# EAGLE design MODULO1 (EAGLE 7.1.0)
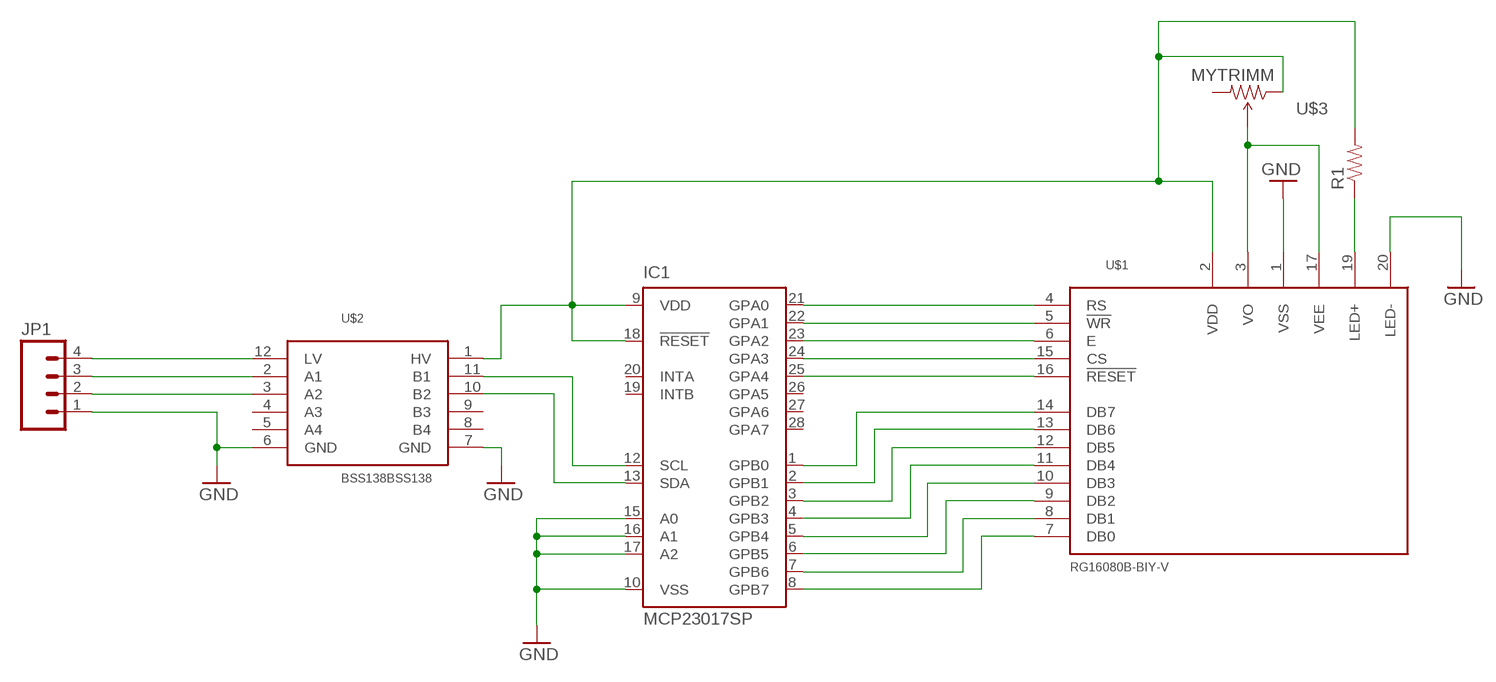
[diagram p0: schematic, sheet 1]

## Parts
IC1  MCP23017SP  [DIL28-3]
JP1  M04PTH  [1X04]
R1  RESISTOR0805-RES  [0805]
U$1  RG16080B-BIY-V  [1X20]
U$2  BSS138BSS138  [BSS138]
U$3  MYTRIMM  [MYTRIMM]

## Nets
GND: IC1.10(VSS) IC1.15(A0) IC1.16(A1) IC1.17(A2) JP1.1 U$1.1(VSS) U$1.20(LED-) U$2.6(GND) U$2.7(GND)
N$1: IC1.21(GPA0) U$1.4(RS)
N$2: IC1.22(GPA1) U$1.5(!WR)
N$3: IC1.23(GPA2) U$1.6(E)
N$4: IC1.24(GPA3) U$1.15(CS)
N$5: IC1.25(GPA4) U$1.16(!RESET)
N$6: IC1.1(GPB0) U$1.14(DB7)
N$7: IC1.2(GPB1) U$1.13(DB6)
N$8: IC1.3(GPB2) U$1.12(DB5)
N$9: IC1.4(GPB3) U$1.11(DB4)
N$10: IC1.5(GPB4) U$1.10(DB3)
N$11: IC1.6(GPB5) U$1.9(DB2)
N$12: IC1.7(GPB6) U$1.8(DB1)
N$13: IC1.8(GPB7) U$1.7(DB0)
N$14: IC1.9(VDD) IC1.18(!RESET) R1.2 U$1.2(VDD) U$2.1(HV) U$3.1(CCW)
N$15: IC1.12(SCL) U$2.11(B1)
N$16: IC1.13(SDA) U$2.10(B2)
N$17: JP1.4 U$2.12(LV)
N$18: JP1.3 U$2.2(A1)
N$19: JP1.2 U$2.3(A2)
N$21: U$1.3(VO) U$1.17(VEE) U$3.2(WIPER)
N$22: R1.1 U$1.19(LED+)
Unconnected: IC1.19(INTB) IC1.20(INTA) IC1.26(GPA5) IC1.27(GPA6) IC1.28(GPA7) U$2.4(A3) U$2.5(A4) U$2.8(B4) U$2.9(B3) U$3.3(CW)

## Library data of the parts
IC1 = microchip:MCP23017: http://ww1.microchip.com/downloads/en/DeviceDoc/21952a.pdf Source: http://ww1.microchip.com/downloads/en/DeviceDoc/21952a.pdf; MF: MICROCHIP; MPN: MCP23017-E/SP; OC_FARNELL: 1332088; OC_NEWARK: 31K2959
JP1 = SparkFun-Connectors:M04: Header 4 Standard 4-pin 0.1" header. Use with straight break away headers (SKU : PRT-00116), right angle break away headers (PRT-00553), swiss pins (PRT-00743), machine pins (PRT-00117), and female headers (PRT-00115). Molex polarized connector foot print use with SKU : PRT-08231 with associated crimp pins and housings. 1MM SMD Version SKU: PRT-10208
R1 = SparkFun-Resistors:RESISTOR: Resistor Basic schematic elements and footprints for 0603, 1206, and PTH resistors.
U$1 = SparkFun-Displays:RG16080B-BIY-V
U$2 = SparkFun-DigitalIC:BSS138: Description: Logic Coverter
U$3 = SparkFun-Electromechanical:MYTRIMM

## Board
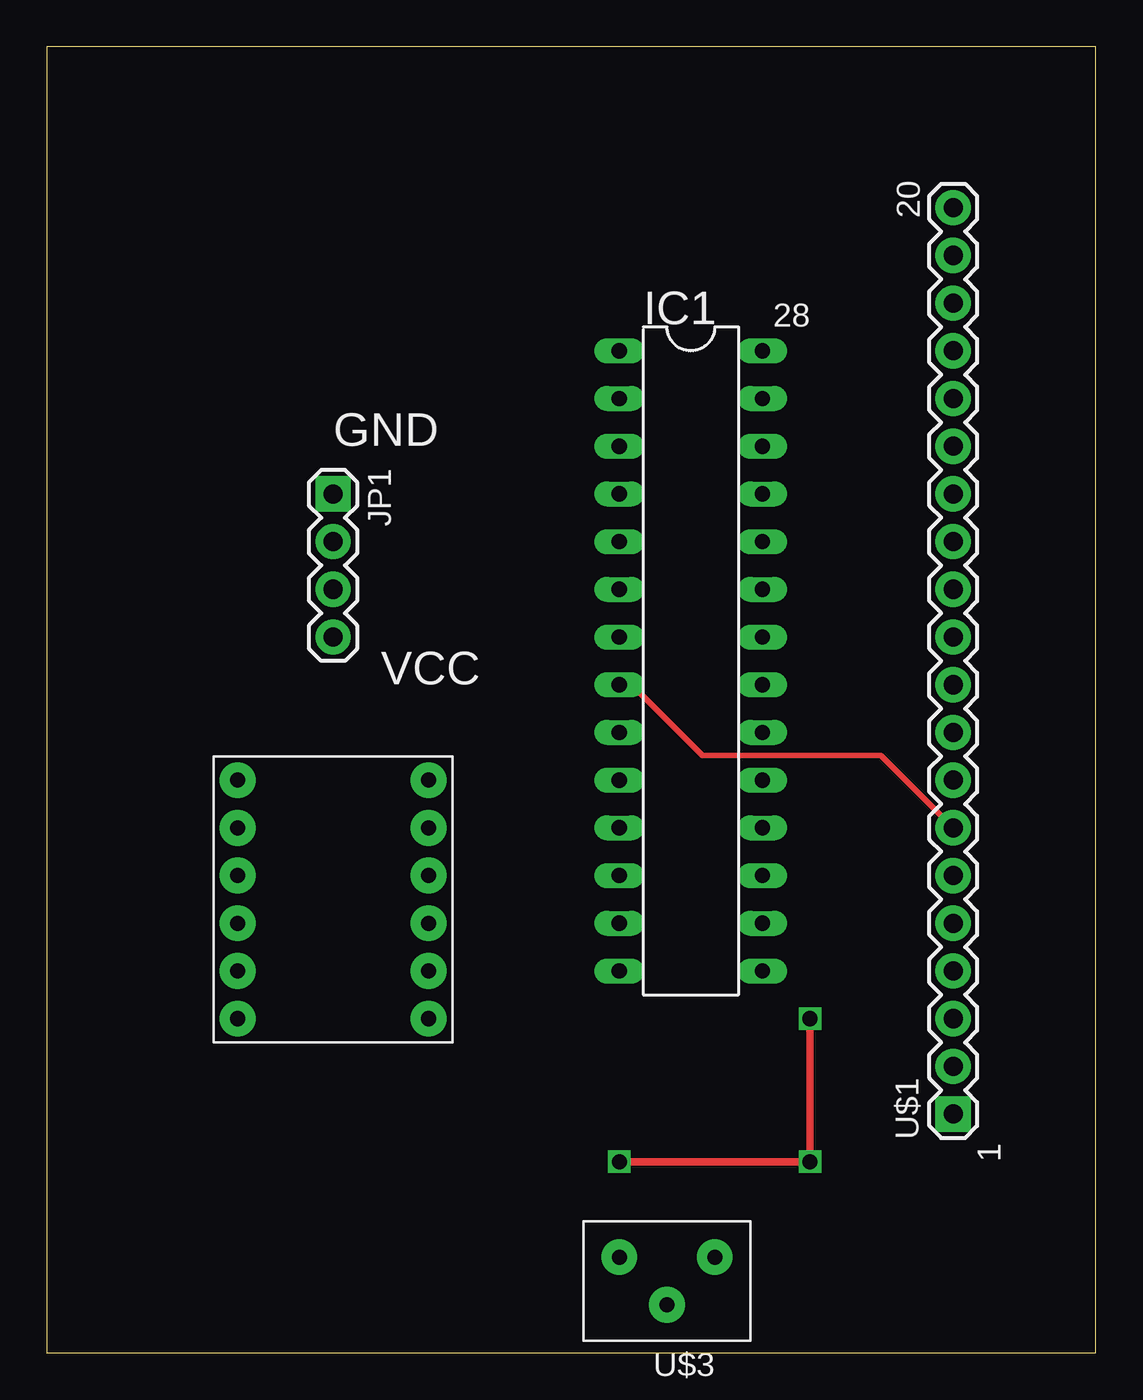
[diagram p1: board, top side]
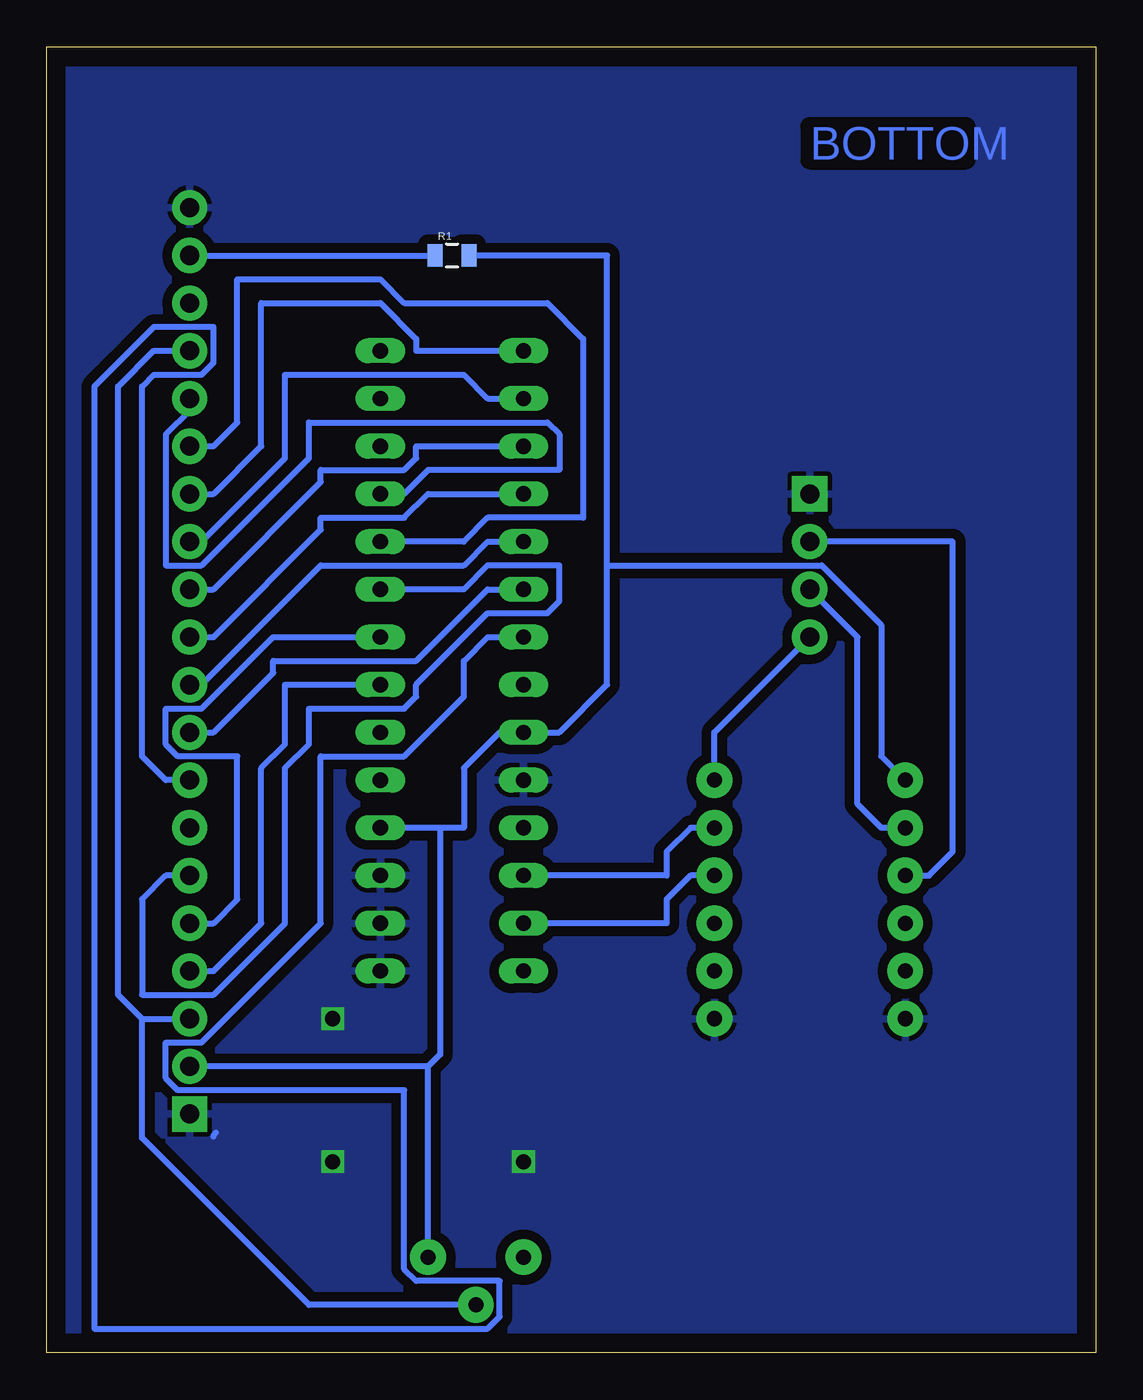
[diagram p2: board, bottom side, seen from below]

Size 55.86 x 69.52 mm. Coordinates in mm from the lower left corner, seen from the top.
Outline: 0,0 55.86,0 55.86,69.52 0,69.52 0,0
Copper layers (1*16): Top 0.035mm / dielectric 1.5mm / Bottom 0.035mm
Design rules "default *": minimum track width 13mil, minimum drill 24mil, track to track 20mil, track to pad 6mil, pad to pad 8mil, via to via 8mil, smd to smd 8mil, copper to edge 40mil, drill to drill 8mil, minimum pad ring 10mil, minimum via ring 8mil, stop-mask expansion 4mil, vias tented up to drill 0mil, thermal gap 10mil

### Footprints (pad centres in the part's own frame; a part is rotated, then mirrored left to right if it is on the bottom)
DIL28-3 = drill 0.813 long: 1 -16.51,-3.81; 2 -13.97,-3.81; 3 -11.43,-3.81; 4 -8.89,-3.81; 5 -6.35,-3.81; 6 -3.81,-3.81; 7 -1.27,-3.81; 8 1.27,-3.81; 9 3.81,-3.81; 10 6.35,-3.81; 11 8.89,-3.81; 12 11.43,-3.81; 13 13.97,-3.81; 14 16.51,-3.81; 15 16.51,3.81; 16 13.97,3.81; 17 11.43,3.81; 18 8.89,3.81; 19 6.35,3.81; 20 3.81,3.81; 21 1.27,3.81; 22 -1.27,3.81; 23 -3.81,3.81; 24 -6.35,3.81; 25 -8.89,3.81; 26 -11.43,3.81; 27 -13.97,3.81; 28 -16.51,3.81
1X04 = drill 1.016 pad 1.88 square: 1 0,0 | drill 1.016 pad 1.88: 2 2.54,0; 3 5.08,0; 4 7.62,0
0805 = smd 0.8 x 1.2: 1 -0.9,0; 2 0.9,0
1X20 = drill 1.016 pad 1.88 square: 1 0,0 | drill 1.016 pad 1.88: 2 2.54,0; 3 5.08,0; 4 7.62,0; 5 10.16,0; 6 12.7,0; 7 15.24,0; 8 17.78,0; 9 20.32,0; 10 22.86,0; 11 25.4,0; 12 27.94,0; 13 30.48,0; 14 33.02,0; 15 35.56,0; 16 38.1,0; 17 40.64,0; 18 43.18,0; 19 45.72,0; 20 48.26,0
BSS138 = drill 0.8 pad 1.905: 1 -5.08,6.35; 2 -5.08,3.81; 3 -5.08,1.27; 4 -5.08,-1.27; 5 -5.08,-3.81; 6 -5.08,-6.35; 7 5.08,-6.35; 8 5.08,-3.81; 9 5.08,-1.27; 10 5.08,1.27; 11 5.08,3.81; 12 5.08,6.35
MYTRIMM = drill 0.8 pad 1.905: 1 -2.54,0; 2 0,2.54; 3 2.54,0

### Placement (x,y rotation side)
IC1  34.29,36.83 270 top
JP1  15.24,45.72 270 top
R1  34.29,58.42 0 bottom
U$1  48.26,12.7 90 top
U$2  15.24,24.13 0 top
U$3  33.02,5.08 180 top

### Tracks (layer width: path | path; a pad name or v marks a point on that pad's centre or on a via)
GND  (via drill 0.8)
  Top 0.406: v30.48,10.16 v40.64,10.16 v40.64,17.78
  Bottom 0.33: 47,11.5 46.86,11.7
  pour Bottom (isolate 0.508): 0,0 0,68.58 55.88,68.58 55.88,0
N$1
  Bottom 0.33: IC1.21 43.18,35.56 43.18,32.38 44.45,31.11 44.45,22.86 46.99,20.32 U$1.4
N$2
  Bottom 0.33: IC1.22 43.81,38.1 47.62,34.29 49.53,34.29 49.53,32.38 48.9,31.75 45.72,31.75 45.72,24.13 46.99,22.86 U$1.5
N$3
  Bottom 0.33: IC1.23 33.66,40.64 32.38,41.91 28.57,41.91 28.57,40.01 29.21,39.37 32.38,39.37 36.2,35.56 36.2,34.92 36.83,34.29 41.91,34.29 41.91,32.38 43.18,31.11 43.18,22.86 46.99,19.05 50.8,19.05 50.8,24.13 49.53,25.4 U$1.6
N$4
  Bottom 0.33: IC1.24 33.66,43.18 32.38,44.45 27.3,44.45 27.3,53.98 29.21,55.88 36.83,55.88 38.1,57.15 45.72,57.15 45.72,49.53 46.99,48.26 U$1.15
N$5
  Bottom 0.33: IC1.25 36.83,45.72 35.56,46.99 28.57,46.99 28.57,48.9 29.21,49.53 41.91,49.53 41.91,47.62 47.62,41.91 49.53,41.91 49.53,48.9 48.26,50.16 U$1.16
N$6
  Bottom 0.33: IC1.1 36.2,53.34 36.2,53.98 38.1,55.88 44.45,55.88 44.45,48.26 46.99,45.72 U$1.14
N$7
  Bottom 0.33: IC1.2 32.38,50.8 33.66,52.07 43.18,52.07 43.18,47.62 47.62,43.18 U$1.13
N$8
  Bottom 0.33: IC1.3 36.2,48.26 36.2,47.62 36.83,46.99 41.27,46.99 41.27,46.35 46.99,40.64 U$1.12
N$9
  Bottom 0.33: IC1.4 35.56,45.72 36.83,44.45 41.27,44.45 41.27,43.81 46.99,38.1 U$1.11
N$10
  Bottom 0.33: IC1.5 32.38,43.18 33.66,41.91 41.27,41.91 47.62,35.56 U$1.10
N$11
  Bottom 0.33: IC1.6 32.38,40.64 36.2,36.83 43.81,36.83 43.81,36.2 46.99,33.02 U$1.9
N$12
  Bottom 0.33: IC1.7 32.38,38.1 33.66,36.83 33.66,34.92 36.83,31.75 41.27,31.75 41.27,22.86 47.62,16.51 49.53,16.51 49.53,14.61 48.9,13.97 36.83,13.97 36.83,4.45 36.2,3.81 31.75,3.81 31.75,1.91 32.38,1.27 53.34,1.27 53.34,51.44 50.16,54.61 46.99,54.61 46.99,52.7 47.62,52.07 50.16,52.07 50.8,51.44 50.8,31.75 49.53,30.48 U$1.8
N$13
  Top 0.305: IC1.8 31.14,35.56 34.9,31.8 44.4,31.8 U$1.7
N$14
  Bottom 0.33: 35.56,15.24 U$1.2 | U$3.1 35.56,15.24 | R1.2 26.04,58.42 26.04,41.91 | 26.04,41.91 26.04,35.56 28.57,33.02 IC1.9 31.75,33.02 33.66,31.11 33.66,27.94 34.92,27.94 | 34.92,27.94 IC1.18 | U$2.1 11.43,31.75 11.43,38.73 14.61,41.91 26.04,41.91 | 35.56,15.24 34.92,15.88 34.92,27.94
N$15
  Bottom 0.33: IC1.12 22.86,25.4 22.86,26.67 21.59,27.94 U$2.11
N$16
  Bottom 0.33: IC1.13 22.86,22.86 22.86,24.13 21.59,25.4 U$2.10
N$17
  Bottom 0.33: JP1.4 20.32,33.02 U$2.12
N$18
  Bottom 0.33: JP1.3 12.7,38.1 12.7,29.21 11.43,27.94 U$2.2
N$19
  Bottom 0.33: JP1.2 7.62,43.18 7.62,26.67 8.89,25.4 U$2.3
N$21
  Bottom 0.33: 50.8,17.78 U$1.3 | 50.8,17.78 50.8,11.43 41.91,2.54 U$3.2 | U$1.17 50.16,53.34 52.07,51.44 52.07,19.05 50.8,17.78
N$22
  Bottom 0.33: U$1.19 R1.1

### Text on the board
Bottom: BOTTOM
tPlace: 20 | 28 | GND | VCC | 1